# Altium project MainBoard.PrjPCB (part 2 of 2)
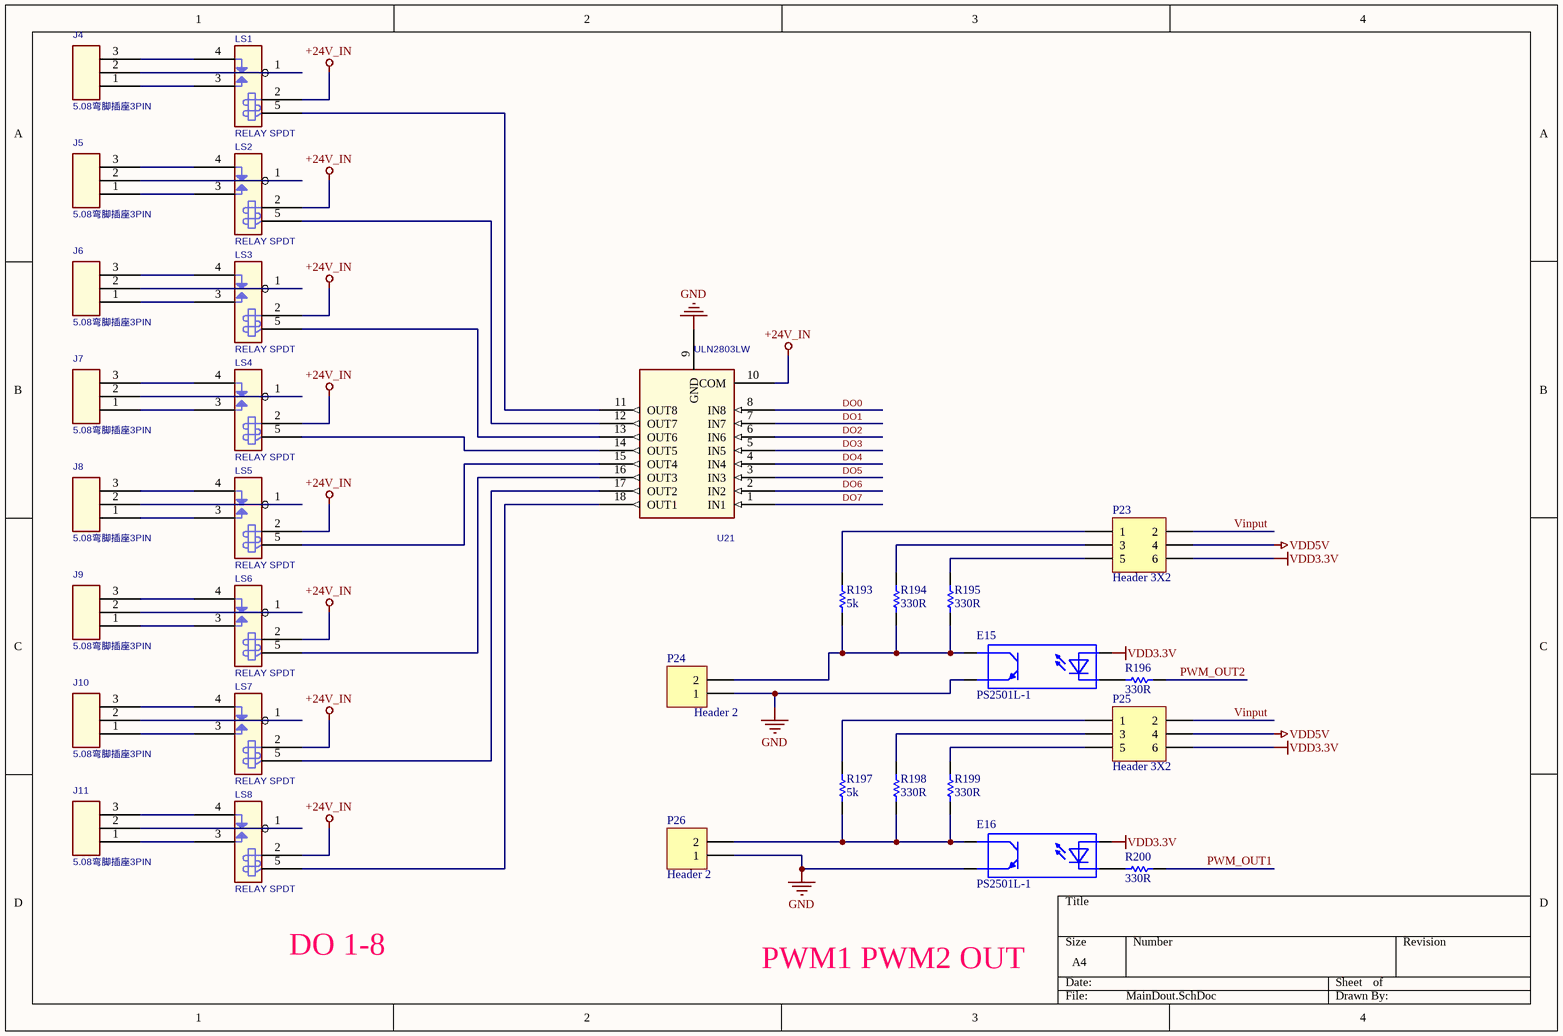
[diagram p10: MainDout.SchDoc]

## Nets that join several sheets
GND: MainCon (11 pins), MainPower (21 pins), MainRTD (J15.5 J15.6 J15.7 J15.8), Main485 (E1.3 E4.3), MainDin (16 pins), MainDout (5 pins)
GND_485-1: MainPower (B1.3 C68.1 C69.1), Main485 (7 pins)
GND_485-2: MainPower (B2.3 C70.1 C71.1), Main485 (7 pins)
SGND: MainPower (12 pins), MainDAC (91 pins), MainADC (58 pins), MainMux (33 pins)
VCC5V: MainPower (C77.1 C79.1 IC2.2 IC2.4), MainDAC (U9.4 U16.4), MainADC (13 pins)
VCC_485-1: MainPower (B1.4 C68.2 C69.2), Main485 (5 pins)
VCC_485-2: MainPower (B2.4 C70.2 C71.2), Main485 (5 pins)
VDD3.3V: MainCon (D13.1), MainPower (C66.1 C83.1 IC1.2 IC1.4), MainDAC (U9.12 U16.12 U16.13), Main485 (6 pins), MainDin (8 pins), MainDout (E15.1 E16.1 P23.6 P25.6)
VDD5V: MainCon (C19.1 C20.2 U6.34), MainPower (8 pins), MainRTD (J15.1 J15.2 J15.3 J15.4), MainDout (P23.4 P25.4)
Vinput: MainPower (6 pins), MainDout (11 pins)
AI_SN1: MainADC (D1.2 R23.1 R24.2 R30.1), MainMux (U22.2)
AI_SN2: MainADC (D2.2 R25.1 R26.2 R31.1), MainMux (U22.7)
AI_SN3: MainADC (D3.2 R35.1 R36.2 R39.1), MainMux (U22.10)
AI_SN4: MainADC (D4.2 R37.1 R38.2 R40.1), MainMux (U22.15)
AI_SN5: MainADC (D5.2 R44.1 R45.2 R51.1), MainMux (U24.2)
AI_SN6: MainADC (D6.2 R46.1 R47.2 R52.1), MainMux (U24.7)
AI_SN7: MainADC (D7.2 R53.1 R54.2 R57.1), MainMux (U24.10)
AI_SN8: MainADC (D8.2 R55.1 R56.2 R58.1), MainMux (U24.15)
AI_SN9: MainADC (D9.2 R65.1 R66.2 R69.1), MainMux (U26.2)
AI_SN10: MainADC (D10.2 R67.1 R68.2 R70.1), MainMux (U26.7)
AI_SN11: MainADC (D11.2 R71.1 R72.2 R75.1), MainMux (U26.10)
AI_SN12: MainADC (D12.2 R73.1 R74.2 R76.1), MainMux (U26.15)
AI_SP1: MainADC (R23.2 RT5.2), MainMux (D44.2 U22.3)
AI_SP2: MainADC (R25.2 RT6.2), MainMux (D45.2 U22.6)
AI_SP3: MainADC (R35.2 RT7.2), MainMux (D46.2 U22.11)
AI_SP4: MainADC (R37.2 RT8.2), MainMux (D47.2 U22.14)
AI_SP5: MainADC (R44.2 RT9.2), MainMux (D48.2 U24.3)
AI_SP6: MainADC (R46.2 RT10.2), MainMux (D49.2 U24.6)
AI_SP7: MainADC (R53.2 RT11.2), MainMux (D50.2 U24.11)
AI_SP8: MainADC (R55.2 RT12.2), MainMux (D51.2 U24.14)
AI_SP9: MainADC (R65.2 RT13.2), MainMux (D52.2 U26.3)
AI_SP10: MainADC (R67.2 RT14.2), MainMux (D53.2 U26.6)
AI_SP11: MainADC (R71.2 RT15.2), MainMux (D54.2 U26.11)
AI_SP12: MainADC (R73.2 RT16.2), MainMux (D55.2 U26.14)
AICT1: MainCon (U6.39), MainMux (U22.1)
AICT2: MainCon (U6.7), MainMux (U22.8)
AICT3: MainCon (U6.40), MainMux (U22.9)
AICT4: MainCon (U6.8), MainMux (U22.16)
AICT5: MainCon (U6.41), MainMux (U24.1)
AICT6: MainCon (U6.9), MainMux (U24.8)
AICT7: MainCon (U6.42), MainMux (U24.9)
AICT8: MainCon (U6.10), MainMux (U24.16)
AICT9: MainCon (U6.2), MainMux (U26.1)
AICT10: MainCon (U6.35), MainMux (U26.8)
AICT11: MainCon (U6.3), MainMux (U26.9)
AICT12: MainCon (U6.36), MainMux (U26.16)
AIO1: MainDAC (R100.2), MainMux (U23.4)
AIO2: MainDAC (R101.2), MainMux (U23.7)
AIO3: MainDAC (R120.2), MainMux (U23.14)
AIO4: MainDAC (R121.2), MainMux (U23.17)
AIO5: MainDAC (R140.2), MainMux (U25.4)
AIO6: MainDAC (R141.2), MainMux (U25.7)
AIO7: MainDAC (R164.2), MainMux (U25.14)
AIO8: MainDAC (R165.2), MainMux (U25.17)
AOCT1: MainCon (U6.48), MainMux (U23.1)
AOCT2: MainCon (U6.16), MainMux (U23.10)
AOCT3: MainCon (U6.49), MainMux (U23.11)
AOCT4: MainCon (U6.19), MainMux (U23.20)
AOCT5: MainCon (U6.52), MainMux (U25.1)
AOCT6: MainCon (U6.20), MainMux (U25.10)
AOCT7: MainCon (U6.53), MainMux (U25.11)
AOCT8: MainCon (U6.21), MainMux (U25.20)
AVCC+12V: MainPower (6 pins), MainDAC (32 pins), MainMux (5 pins)
AVCC-12V: MainPower (C76.2 L16.1), MainDAC (8 pins), MainMux (5 pins)
AVO1: MainDAC (R102.1 U10.1), MainMux (U23.2)
AVO2: MainDAC (R103.1 U10.14), MainMux (U23.9)
AVO3: MainDAC (R116.1 U13.1), MainMux (U23.12)
AVO4: MainDAC (R117.1 U13.14), MainMux (U23.19)
AVO5: MainDAC (R146.1 U17.1), MainMux (U25.2)
AVO6: MainDAC (R147.1 U17.14), MainMux (U25.9)
AVO7: MainDAC (R160.1 U20.1), MainMux (U25.12)
AVO8: MainDAC (R161.1 U20.14), MainMux (U25.19)
DAC_Din: MainCon (U6.79), MainDAC (R93.2 R139.2)
DAC_LDAC: MainCon (U6.111), MainDAC (R86.2 R134.2)
DAC_Sclk: MainCon (U6.112), MainDAC (R94.2 R142.2)
DAC_SYNC: MainCon (U6.80), MainDAC (R99.2 R144.2)
DO0: MainCon (U6.28), MainDout (U21.8)
DO1: MainCon (U6.61), MainDout (U21.7)
DO2: MainCon (U6.29), MainDout (U21.6)
DO3: MainCon (U6.62), MainDout (U21.5)
DO4: MainCon (U6.30), MainDout (U21.4)
DO5: MainCon (U6.63), MainDout (U21.3)
DO6: MainCon (U6.31), MainDout (U21.2)
DO7: MainCon (U6.64), MainDout (U21.1)
DSI0: MainCon (U6.43), MainDin (E7.3 R169.1 R170.1)
DSI1: MainCon (U6.11), MainDin (E8.3 R172.1 R173.1)
DSI2: MainCon (U6.44), MainDin (E9.3 R175.1 R176.1)
DSI3: MainCon (U6.24), MainDin (E10.3 R178.1 R179.1)
DSI4: MainCon (U6.57), MainDin (E11.3 R181.1 R182.1)
DSI5: MainCon (U6.25), MainDin (E12.3 R184.1 R185.1)
DSI6: MainCon (U6.58), MainDin (E13.3 R187.1 R188.1)
DSI7: MainCon (U6.26), MainDin (E14.3 R190.1 R191.1)
PWM_OUT1: MainCon (U6.89), MainDout (R200.2)
PWM_OUT2: MainCon (U6.128), MainDout (R196.2)
RDY/ALERT1: MainCon (U6.125), MainADC (R28.2 R32.1)
RDY/ALERT2: MainCon (U6.91), MainADC (R48.1)
RDY/ALERT3: MainCon (U6.124), MainADC (R62.1)
REF5V: MainPower (C80.1 U29.6), MainDAC (12 pins)
RS485_CON_1: MainCon (U6.87), Main485 (E2.2)
RS485_CON_2: MainCon (U6.109), Main485 (E5.2)
RS485_TX1: MainCon (U6.120), Main485 (E3.2)
RS485_TX2: MainCon (U6.110), Main485 (E6.2)
SCL: MainCon (U6.92), MainADC (R29.2 R33.1 R49.1 R63.1)
SDA: MainCon (U6.126), MainADC (R27.2 R34.1 R50.1 R64.1)
SPI_MISO_3: MainCon (U6.106), MainRTD (J15.19 J15.20)
SPI_MOSI_3: MainCon (U6.73), MainRTD (J15.13 J15.14)
SPI_nCS_3_0: MainCon (U6.103), MainRTD (J15.17 J15.18)
SPI_SCK_3: MainCon (U6.74), MainRTD (J15.15 J15.16)
USART_RX1: MainCon (U6.86), Main485 (E1.4 R2.1)
USART_RX2: MainCon (U6.77), Main485 (E4.4 R13.1)